# Altium project smart home3-2.PrjPcb
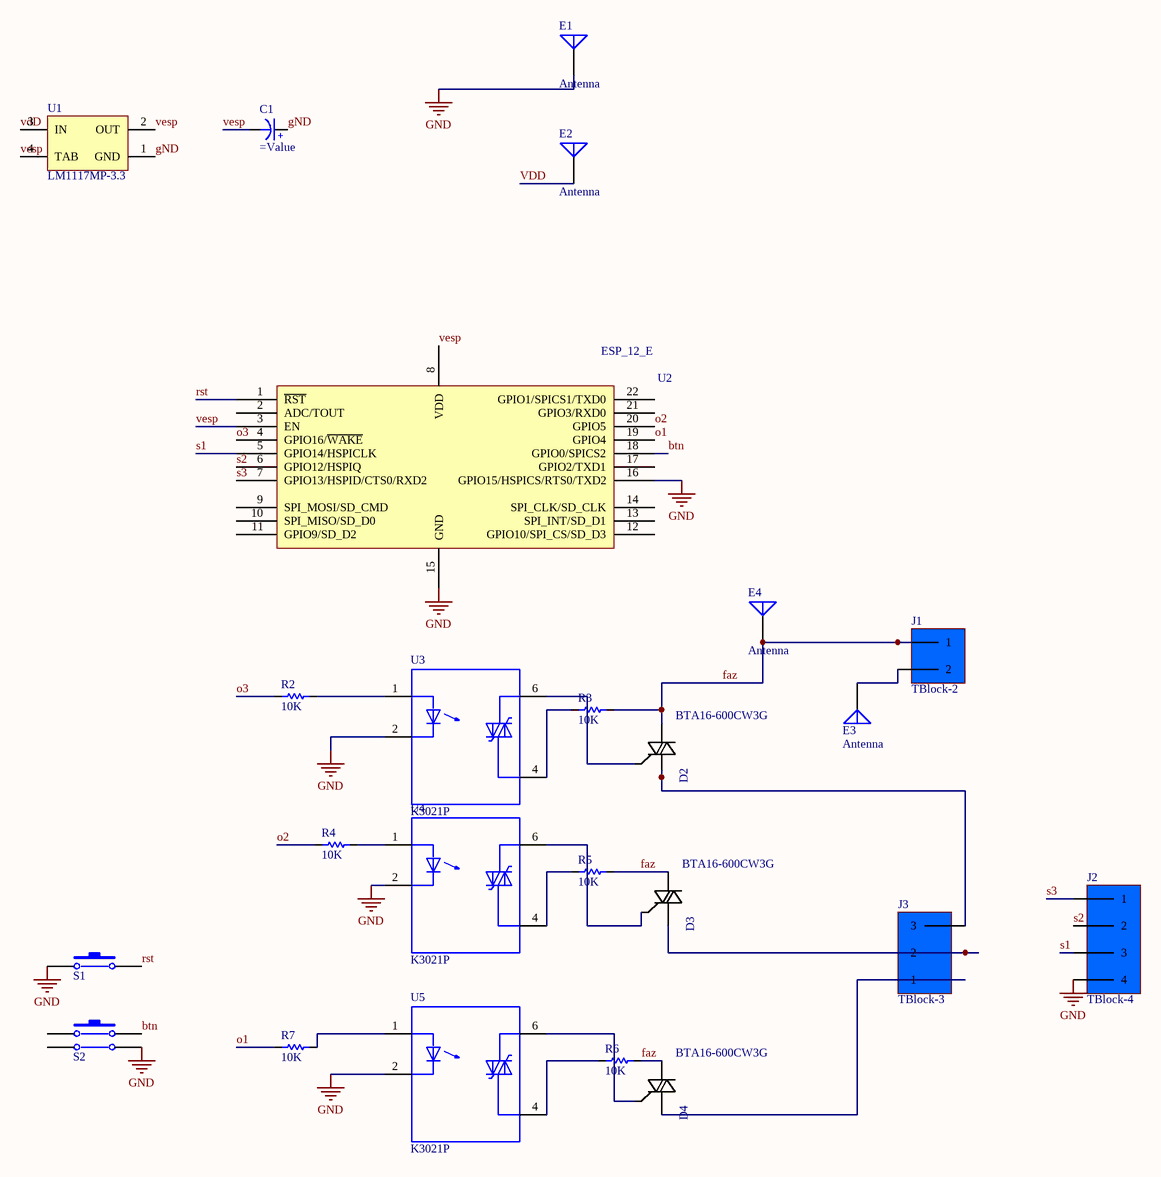
[diagram p0: smart home3-2.SchDoc]
1 sheet, 24 parts. Net scope: global (net labels, ports and power ports of the same name join across sheets).
Board file: smart home3-2.PcbDoc

## Sheet smart home3-2.SchDoc
size A3

### Parts
C1  (no value)  [ELEC-CAP-RAD10-20]
D2  BTA16-600CW3G  [*TO254P1028X482X1968-3]
D3  BTA16-600CW3G  [*TO254P1028X482X1968-3]
D4  BTA16-600CW3G  [*TO254P1028X482X1968-3]
E1  Antenna  [PIN1]
E2  Antenna  [PIN1]
E3  Antenna  [PIN1]
E4  Antenna  [PIN1]
J1  TBlock-2  [KF300-2 PIN]
J2  TBlock-4  [KF300-4 PIN]
J3  TBlock-3  [KF300-3 PIN]
R2  10K  [RES 1206 (3216X08L)]
R3  10K  [RES 1206 (3216X08L)]
R4  10K  [RES 1206 (3216X08L)]
R5  10K  [RES 1206 (3216X08L)]
R6  10K  [RES 1206 (3216X08L)]
R7  10K  [RES 1206 (3216X08L)]
S1  PB-2pin  [PB-2pin]  (value not drawn)
S2  PUSH BUTTON DOUBLE  [PUSH BUTTON]  (value not drawn)
U1  LM1117MP-3.3  [MP04A_N]
U2  ESP_12_E  [ESP_12_E]
U3  K3021P  [DIP762W50P254L730H410Q6]
U4  K3021P  [DIP762W50P254L730H410Q6]
U5  K3021P  [DIP762W50P254L730H410Q6]

### Nets
gND: C1.2(+) E1.1(A) J2.4 S1.1 S2.4 U1.1(GND) U2.15(GND) U2.16(GPIO15/HSPICS/RTS0/TXD2) U3.2(C) U4.2(C) U5.2(C)
btn: S2.2 U2.18(GPIO0/SPICS2)
faz: D2.2(MT2) D3.2(MT2) D4.2(MT2) E4.1(A) J1.1 R3.2 R5.2 R6.2
o1: R7.1 U2.19(GPIO4)
o2: R4.1 U2.20(GPIO5)
o3: R2.1 U2.4(GPIO16/~{WAKE})
rst: S1.2 U2.1(~{RST})
s1: J2.3 U2.5(GPIO14/HSPICLK)
s2: J2.2 U2.6(GPIO12/HSPIQ)
s3: J2.1 U2.7(GPIO13/HSPID/CTS0/RXD2)
vdD: E2.1(A) U1.3(IN)
vesp: C1.1(-) U1.2(OUT) U1.4(TAB) U2.3(EN) U2.8(VDD)
NetD2_1: D2.1(MT1) J3.3
NetD2_3: D2.3(G) U3.6(MT2)
NetD3_1: D3.1(MT1) J3.2
NetD3_3: D3.3(G) U4.6(MT2)
NetD4_1: D4.1(MT1) J3.1
NetD4_3: D4.3(G) U5.6(MT2)
NetE3_1: E3.1(A) J1.2
NetR2_2: R2.2 U3.1(A)
NetR3_1: R3.1 U3.4(MT1)
NetR4_2: R4.2 U4.1(A)
NetR5_1: R5.1 U4.4(MT1)
NetR6_1: R6.1 U5.4(MT1)
NetR7_2: R7.2 U5.1(A)

Not connected (* = marked no-connect by the designer): S2 1 3; U2 2(ADC/TOUT) 9(SPI_MOSI/SD_CMD) 10(SPI_MISO/SD_D0) 11(GPIO9/SD_D2) 12(GPIO10/SPI_CS/SD_D3) 13(SPI_INT/SD_D1) 14(SPI_CLK/SD_CLK) 17(GPIO2/TXD1) 21(GPIO3/RXD0) 22(GPIO1/SPICS1/TXD0)

### Library data of the parts
C1 = Capacitor Electrolytic: Electrolytic Capacitor
D2-D4 = BTA16-600CW3G: TRIAC Standard 600V 16A Through Hole TO-220AB; MF: Littelfuse Inc.; Package: TO-220 ON Semiconductor; SnapEDA_Link: https://www.snapeda.com/parts/BTA16-600CW3G/Littelfuse%20Inc./view-part/390940/?ref=snap; Mouser-Purchase-URL: https://snapeda.com/shop?store=Mouser&id=390940; DigiKey-Purchase-URL: https://snapeda.com/shop?store=DigiKey&id=390940; Price: None; Arrow_Americas-Purchase-URL: https://snapeda.com/shop?store=Arrow+Americas&id=390940; Availability: Unavailable; MP: BTA16-600CW3G; Value: *
E1-E4 = Antenna: Generic Antenna; Published: 24-Mar-1999; LatestRevisionDate: 17-Jul-2002; LatestRevisionNote: Re-released for DXP Platform.; PackageReference: PIN1; Publisher: Altium Limited
R2-R7 = Resistor: Tolerance: 5%; Power: 1/4 W; Value: 10K
S1 = PB-2pin: Switch; E-mail: picpars@gmail.com; Designer: Seyed Mohsen Ghasemian; Publisher: www.picpars.com; WEB: www.picpars.com
S2 = PUSH BUTTON DOUBLE: Switch
U1 = LM1117MP-3.3: 800mA Low-Dropout Linear Regulator; Manufacturer: National Semiconductor; CompType: LDO IC; PackageTopMarking: XYTT*N05A; PowerWise: N; Published: 4-Dec-2008; DatasheetVersion: Apr-2006; PackageVersion: revB, Apr-2003; PackageReference: MP04A; Publisher: Altium Limited; PackageDescription: Molded SOT-223, 6.50 x 3.56 x 1.6mm Body, 4 Lead, 2.3mm Pitch; PartNumber: LM1117MP-3.3; RoHS: O; PinCount: 4; DigiKeyPartNumber: LM1117MP-3.3CT-ND; Code_JEDEC: TO-261-AA; Code_IPC: SOT223-4; ComponentLink1Description: LM1117 Datasheet; ComponentLink1URL: http://www.national.com/ds/LM/LM1117.pdf; ComponentLink2Description: LM1117 Web Page; ComponentLink2URL: http://www.national.com/pf/LM/LM1117.html; ComponentLink3Description: MP04A Package Page; ComponentLink3URL: http://www.national.com/packaging/folders/mp04a.html
U2 = ESP_12_E: ESP-12 Wi-Fi Module by AI-Thinker; IC: ESP8266-EX; Vendor: Ai-thinker
U3-U5 = K3021P: Optoisolator Triac Output 5300Vrms 1 Channel 6-DIP; MF: Vishay Semiconductor; Package: DIP-6 Vishay; Availability: Unavailable; Value: *; MP: K3021P; Mouser-Purchase-URL: https://snapeda.com/shop?store=Mouser&id=291595; SnapEDA_Link: https://www.snapeda.com/parts/K3021P/Vishay%20Semiconductor%20Opto%20Division/view-part/291595/?ref=snap; Price: None; DigiKey-Purchase-URL: https://snapeda.com/shop?store=DigiKey&id=291595